# Altium schematic sheet Driver Morpheus SENSOR CORRENTE.SchDoc
size A4
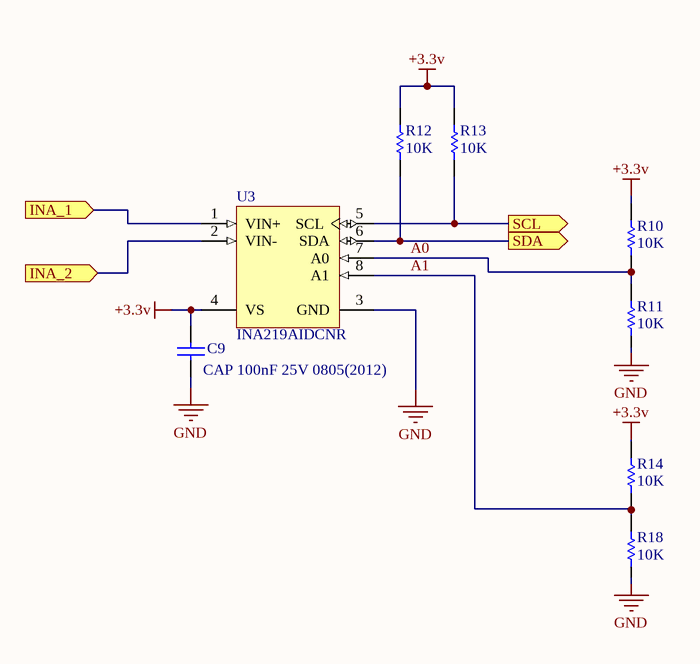
[diagram p0: Driver Morpheus SENSOR CORRENTE.SchDoc]

## Parts
C9  CAP 100nF 25V 0805(2012)  [CAPC0805(2012)145_M]
R10  value 10K  [RES-0402]  (hidden comment: RC0402JR-071KL)
R11  value 10K  [RES-0402]  (hidden comment: RC0402JR-071KL)
R12  value 10K  [RES-0402]  (hidden comment: RC0402JR-071KL)
R13  value 10K  [RES-0402]  (hidden comment: RC0402JR-071KL)
R14  value 10K  [RES-0402]  (hidden comment: RC0402JR-071KL)
R18  value 10K  [RES-0402]  (hidden comment: RC0402JR-071KL)
U3  INA219AIDCNR  [DCN0008A_M]

## Ports
INA_1 (in), INA_2 (in), SCL (out), SDA (out)

## Nets
+3.3v: C9.2 R10.2 R12.2 R13.2 R14.2 U3.4(VS)
GND: C9.1 R11.1 R18.1 U3.3(GND)
A0: R10.1 R11.2 U3.7(A0)
A1: R14.1 R18.2 U3.8(A1)
INA_1: U3.1(VIN+) ; port INA_1
INA_2: U3.2(VIN-) ; port INA_2
SCL: R13.1 U3.5(SCL) ; port SCL
SDA: R12.1 U3.6(SDA) ; port SDA

## Library data of the parts
C9 = CMP-1036-04408-1: CAP 100nF 25V ±5% 0805 (2012 Metric) Thickness 1.45mm SMD; Case-Metric: 2012; Case-EIA: 0805; Tolerance: Â±5%; Value: 100nF; Rated Voltage: 25 V; Max Thickness: 1.45 mm; Technology: SMT
R10-R14 R18 = RES 1K 0402: RES SMD 1K OHM 5% 1/16W 0402
U3 = CMP-0704-00041-2: Zero-Drift, Bi-directional Current / Power Monitor, 3 to 5.5 V, -40 to 125 degC, 8-pin SOP (DCN8), Green (RoHS & no Sb/Br); Manufacturer: Texas Instruments; Input Offset (+/-)(Max)(uV): 100; Small-Signal Bandwidth(Typ)(MHz): 0.011; SubFamily: Current Shunt Monitor; Rating: Catalog; Quiescent Current (+/-)(Typ)(mA): 0.7; Vs(Max)(V): 5.5; Common Mode Range(Min)(V): 0; Vs(Min)(V): 3; Common Mode Range(Max)(V): 26; Gain(V/V): 1, 0.5, 0.25, 0.125; ComponentLink3URL: http://www.ti.com/lit/ml/mpds099c/mpds099c.pdf; ComponentLink2URL: http://www.ti.com/general/docs/lit/getliterature.tsp?genericPartNumber=INA219&fileType=pdf; PackageReference: DCN0008A; ComponentLink1URL: http://www.ti.com/; ComponentLink1Description: Manufacturer URL; Code_JEDEC: MO-178; CMRR(Min)(dB): 100; DatasheetVersion: SBOS448F; Mounting Technology: Surface Mount; ComponentLink3Description: Package Specification; PartNumber: INA219AIDCNR; PackageVersion: 4202106/D, 11/2009; Eco-Plan: Green (RoHS & no Sb/Br); ComponentLink2Description: Datasheet; PackageDescription: 8-Pin Plastic Small Outline, Body 1.6 x 2.9 mm, Pitch 0.65 mm